# Altium schematic sheet ultrasonic_rx.SchDoc: OPO
size Letter; Author: Kuo, Huang; Revision: 4.0; SheetNumber: 6; SheetTotal: 7
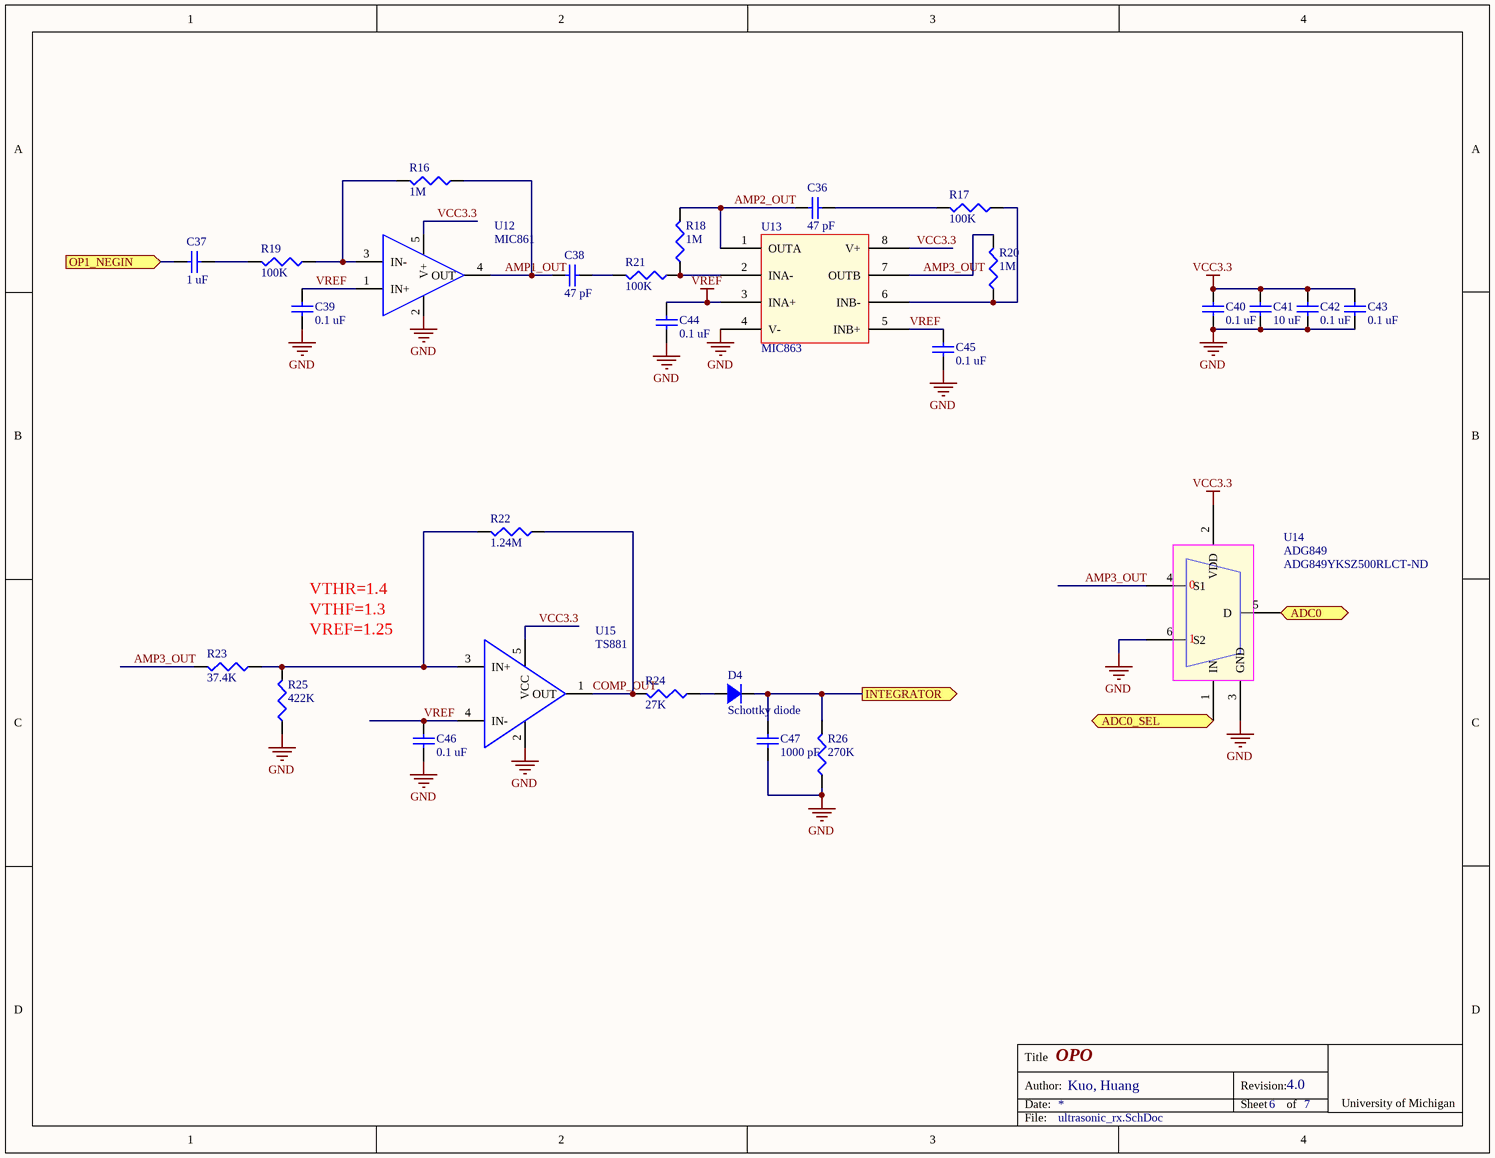
[diagram p0: ultrasonic_rx.SchDoc]

## Parts
C36  value 47 pF  [0402]  (hidden comment: Ceramic capacitor)
C37  value 1 uF  [0402]  (hidden comment: Ceramic capacitor)
C38  value 47 pF  [0402]  (hidden comment: Ceramic capacitor)
C39  value 0.1 uF  [0402]  (hidden comment: Ceramic capacitor)
C40  value 0.1 uF  [0402]  (hidden comment: Ceramic capacitor)
C41  value 10 uF  [0603]  (hidden comment: Ceramic capacitor)
C42  value 0.1 uF  [0402]  (hidden comment: Ceramic capacitor)
C43  value 0.1 uF  [0402]  (hidden comment: Ceramic capacitor)
C44  value 0.1 uF  [0402]  (hidden comment: Ceramic capacitor)
C45  value 0.1 uF  [0402]  (hidden comment: Ceramic capacitor)
C46  value 0.1 uF  [0402]  (hidden comment: Ceramic capacitor)
C47  value 1000 pF  [0402]  (hidden comment: Ceramic capacitor)
D4  Schottky diode  [0603 - DIODE]
R16  value 1M  [0402]  (hidden comment: Chip resistor)
R17  value 100K  [0402]  (hidden comment: Chip resistor)
R18  value 1M  [0402]  (hidden comment: Chip resistor)
R19  value 100K  [0402]  (hidden comment: Chip resistor)
R20  value 1M  [0402]  (hidden comment: Chip resistor)
R21  value 100K  [0402]  (hidden comment: Chip resistor)
R22  value 1.24M  [0402]  (hidden comment: Chip resistor)
R23  value 37.4K  [0402]  (hidden comment: Chip resistor)
R24  value 27K  [0402]  (hidden comment: Chip resistor)
R25  value 422K  [0402]  (hidden comment: Chip resistor)
R26  value 270K  [0402]  (hidden comment: Chip resistor)
U12  MIC861  [SC70-5]
U13  MIC863  [TSOP65P280X145-8N]
U14  ADG849  Supplier Part Number 1: ADG849YKSZ500RLCT-ND  [SC70-6]
U15  TS881  [SC70-5]

## Ports
ADC0, ADC0_SEL, INTEGRATOR (out), OP1_NEGIN (in)

## Nets
GND: C39.2 C40.2 C41.2 C42.2 C43.2 C44.2 C45.2 C46.2 C47.2 R25.2 R26.2 U12.2(V-) U13.4(V-) U14.3(GND) U14.6(S2) U15.2(VEE)
VCC3.3: C40.1 C41.1 C42.1 C43.1 U12.5(V+) U13.8(V+) U14.2(VDD) U15.5(VCC)
VREF: C39.1 C44.1 C45.1 C46.1 U12.1(IN+) U13.3(INA+) U13.5(INB+) U15.4(IN-)
ADC0: U14.5(D) ; port ADC0
ADC0_SEL: U14.1(IN) ; port ADC0_SEL
AMP1_OUT: C38.1 R16.2 U12.4(OUT)
AMP2_OUT: C36.1 R18.1 U13.1(OUTA)
AMP3_OUT: R20.1 R23.1 U13.7(OUTB) U14.4(S1)
COMP_OUT: R22.2 R24.1 U15.1(OUT)
INTEGRATOR: C47.1 D4.2 R26.1 ; port INTEGRATOR
OP1_NEGIN: C37.1 ; port OP1_NEGIN
NetC36_2: C36.2 R17.1
NetC37_2: C37.2 R19.1
NetC38_2: C38.2 R21.1
NetD4_1: D4.1 R24.2
NetR16_1: R16.1 R19.2 U12.3(IN-)
NetR17_2: R17.2 R20.2 U13.6(INB-)
NetR18_2: R18.2 R21.2 U13.2(INA-)
NetR22_1: R22.1 R23.2 R25.1 U15.3(IN+)

## Notes on the sheet
- VTHR=1.4
- VTHF=1.3
- VREF=1.25
- Title
- Date:
- Author:
- Revision:
- Sheet
- of
- University of Michigan
- File:
- (in symbol ADG849) 0

## Library data of the parts
C36 C38 = C_47p_0402_ceramic: Ceramic capacitor, 47 pF, 0402 package; Manufacture: Johanson; voltage rated: 50 V; tolerance: 5%; package: 0402; Supplier 1: Digi-Key; Supplier Part Number 1: 709-1121-1-ND
C37 = C_1u_0402_ceramic: Ceramic capacitor, 1 uF, 0402 package; Manufacture: TDK; voltage rated: 6.3 V; tolerance: 10%; package: 0402; Supplier 1: Digi-Key; Supplier Part Number 1: 445-5000-1-ND
C39 C40 C42-C46 = C_0.1u_0402_ceramic: Ceramic capacitor, 0.1u, 0402 package; Manufacture: TDK; voltage rated: 10 V; tolerance: 10%; Supplier 1: Digi-Key; Supplier Part Number 1: 445-1265-1-ND; package: 0402
C41 = C_10u_0603_ceramic: Ceramic capacitor, 10 uF, 0603 package; Manufacture: TDK; voltage rated: 6.3V; tolerance: 20%; package: 0603; Supplier 1: Digi-Key; Supplier Part Number 1: 445-4112-1-ND
C47 = C_1000p_0402_ceramic: Ceramic capacitor, 1000 pF, 0402 package; Manufacture: TDK; voltage rated: 50 V; tolerance: 10%; package: 0402; Supplier 1: Digi-Key; Supplier Part Number 1: 445-6846-1-ND
D4 = D_SCHOTTKY_30V_0.1A_0603: Schottky diode 30 V 0.1 A 0603; package: 0603; Supplier 1: Digi-Key; Supplier Part Number 1: 641-1282-1-ND
R16 R18 R20 = R_1M_0402: Chip resistor, 1M, 0402 package; tolerance: 1%; power: 1/16 W; Supplier 1: Digi-Key; Supplier Part Number 1: 541-1.00MLCT-ND; package: 0402
R17 R19 R21 = R_100K_0402: Chip resistor, 100K, 0402 package; tolerance: 1%; power: 1/16 W; Supplier 1: Digi-Key; Supplier Part Number 1: 541-100KLCT-ND; package: 0402
R22 = R_1.24M_0402: Chip resistor, 1.24M, 0402 package; tolerance: 1%; power: 1/16 W; package: 0402; Supplier 1: Digi-Key; Supplier Part Number 1: 541-1.24MLCT-ND
R23 = R_37.4K_0402: Chip resistor, 37.4K, 0402 package; tolerance: 1%; power: 1/16 W; package: 0402; Supplier 1: Digi-Key; Supplier Part Number 1: 541-37.4KLCT-ND
R24 = R_27K_0402: Chip resistor, 27K, 0402 package; tolerance: 1%; power: 1/16 W; package: 0402; Supplier 1: Digi-Key; Supplier Part Number 1: 541-27.0KLCT-ND
R25 = R_422K_0402: Chip resistor, 422K, 0402 package; tolerance: 1%; power: 1/16 W; package: 0402; Supplier 1: Digi-Key; Supplier Part Number 1: 541-422KLCT-ND
R26 = R_270K_0402: Chip resistor, 270K, 0402 package; tolerance: 1%; power: 1/16 W; package: 0402; Supplier 1: Digi-Key; Supplier Part Number 1: 541-270KLCT-ND
U12 = MIC861: IC OPAMP 400KHZ 2.7V ULT LP SC70; Supplier 1: Digi-Key; Supplier Part Number 1: 576-2932-1-ND
U13 = MIC863: Dual Ultra Low Power Op Amp in SOT23-8; Supplier 1: Digi-Key; Supplier Part Number 1: 576-2934-1-ND
U14 = ADG849: 0.5 Ω SPDT/2:1 Mux in SC70; Supplier 1: Digi-Key
U15 = TS881: Rail-to-rail 1.1 V nanopower comparator; Supplier 1: Digi-Key; Supplier Part Number 1: 497-13217-1-ND